# EAGLE design ODR_override rev E (EAGLE 7.5.0)
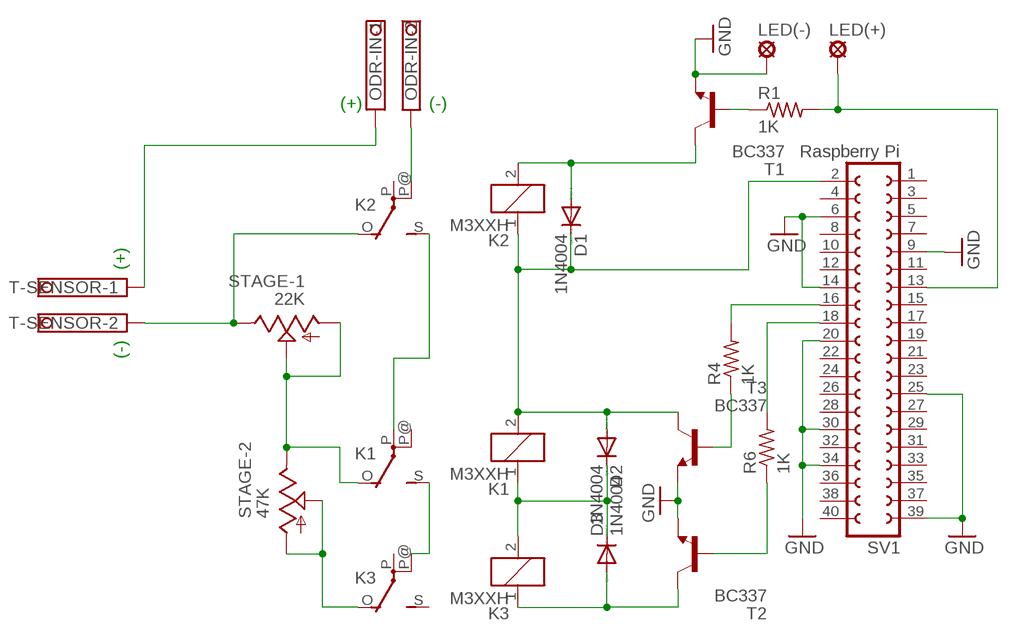
[diagram p0: schematic, sheet 1]

## Parts
D1  1N4004  [DO41-10]
D2  1N4004  [DO41-10]
D3  1N4004  [DO41-10]
K1  M3XXH  [M3XXH]
K2  M3XXH  [M3XXH]
K3  M3XXH  [M3XXH]
LED(+)  LSP11  [LSP11]
LED(-)  LSP11  [LSP11]
ODR-IN  TERMINAL-BLOCK-3.5MM-2-PIN-ROUND-PAD  [TERMINAL-BLOCK-2-PIN-3.5MM-ROUND-PAD]
R1  1K  R-US_0204/5  [0204/5]
R4  1K  R-US_0204/5  [0204/5]
R6  1K  R-US_0204/5  [0204/5]
STAGE-1  22K  TRIM_US-B25P  [B25P]
STAGE-2  47K  TRIM_US-B25P  [B25P]
SV1  Raspberry Pi  FE20-2  [FE20-2]
T1  BC337  [TO92]
T2  BC337  [TO92]
T3  BC337  [TO92]
T-SENSOR  TERMINAL-BLOCK-3.5MM-2-PIN-ROUND-PAD  [TERMINAL-BLOCK-2-PIN-3.5MM-ROUND-PAD]

## Nets
GND: LED(-).MP SV1.6 SV1.9 SV1.14 SV1.20 SV1.25 SV1.30 SV1.34 SV1.39 T1.1(E) T2.1(E) T3.1(E)
N$1: LED(+).MP R1.2 SV1.13
N$2: R1.1 T1.2(B)
N$3: K1.S(2:S) K3.P@(2:P)
N$4: K2.P@(2:P) ODR-IN.2
N$5: D1.C D2.A K1.2 K2.1 SV1.2 T3.3(C)
N$6: D3.A K3.1 T2.3(C)
N$7: ODR-IN.1 T-SENSOR.1
N$8: K1.O(2:O) STAGE-1.A STAGE-1.S STAGE-2.E
N$9: D1.A K2.2 T1.3(C)
N$10: R6.2 SV1.18
N$11: D2.C D3.C K1.1 K3.2
N$12: R4.2 SV1.16
N$13: R6.1 T2.2(B)
N$14: R4.1 T3.2(B)
N$15: K2.O(2:O) STAGE-1.E T-SENSOR.2
N$16: K1.P(2:P) K2.S(2:S)
N$17: K3.O(2:O) STAGE-2.A STAGE-2.S
Unconnected: K1.P@(2:P) K2.P(2:P) K3.P(2:P) K3.S(2:S) SV1.1 SV1.3 SV1.4 SV1.5 SV1.7 SV1.8 SV1.10 SV1.11 SV1.12 SV1.15 SV1.17 SV1.19 SV1.21 SV1.22 SV1.23 SV1.24 SV1.26 SV1.27 SV1.28 SV1.29 SV1.31 SV1.32 SV1.33 SV1.35 SV1.36 SV1.37 SV1.38 SV1.40

## Notes on the sheet
- (+) | (-)
- (+)
- (-)

## Library data of the parts
D1-D3 = diode:1N4004: DIODE general purpose rectifier, 1 A
K1-K3 = relay:M3XXH: RELAY 1 x switch; OC_FARNELL: unknown; OC_NEWARK: unknown
LED(+) LED(-) = solpad:LSP11: SOLDER PAD drill 1.1 mm
ODR-IN T-SENSOR = Rembrandt Electronics - Terminal Block 3-5mm v1-0:TERMINAL-BLOCK-3.5MM-2-PIN: Terminal Block 3.5mm Pitch: 3,5 mm Number of pins: 2 Created by Rembrandt Electronics www.rembrandtelectronics.com
R1 R4 R6 = rcl:R-US_: RESISTOR, American symbol
STAGE-1 STAGE-2 = pot:TRIM_US-: POTENTIOMETER
SV1 = con-lsta:FE20-2: FEMALE HEADER; OC_FARNELL: unknown; OC_NEWARK: unknown
T1-T3 = transistor:BC337: NPN TRANSISTOR

## Board
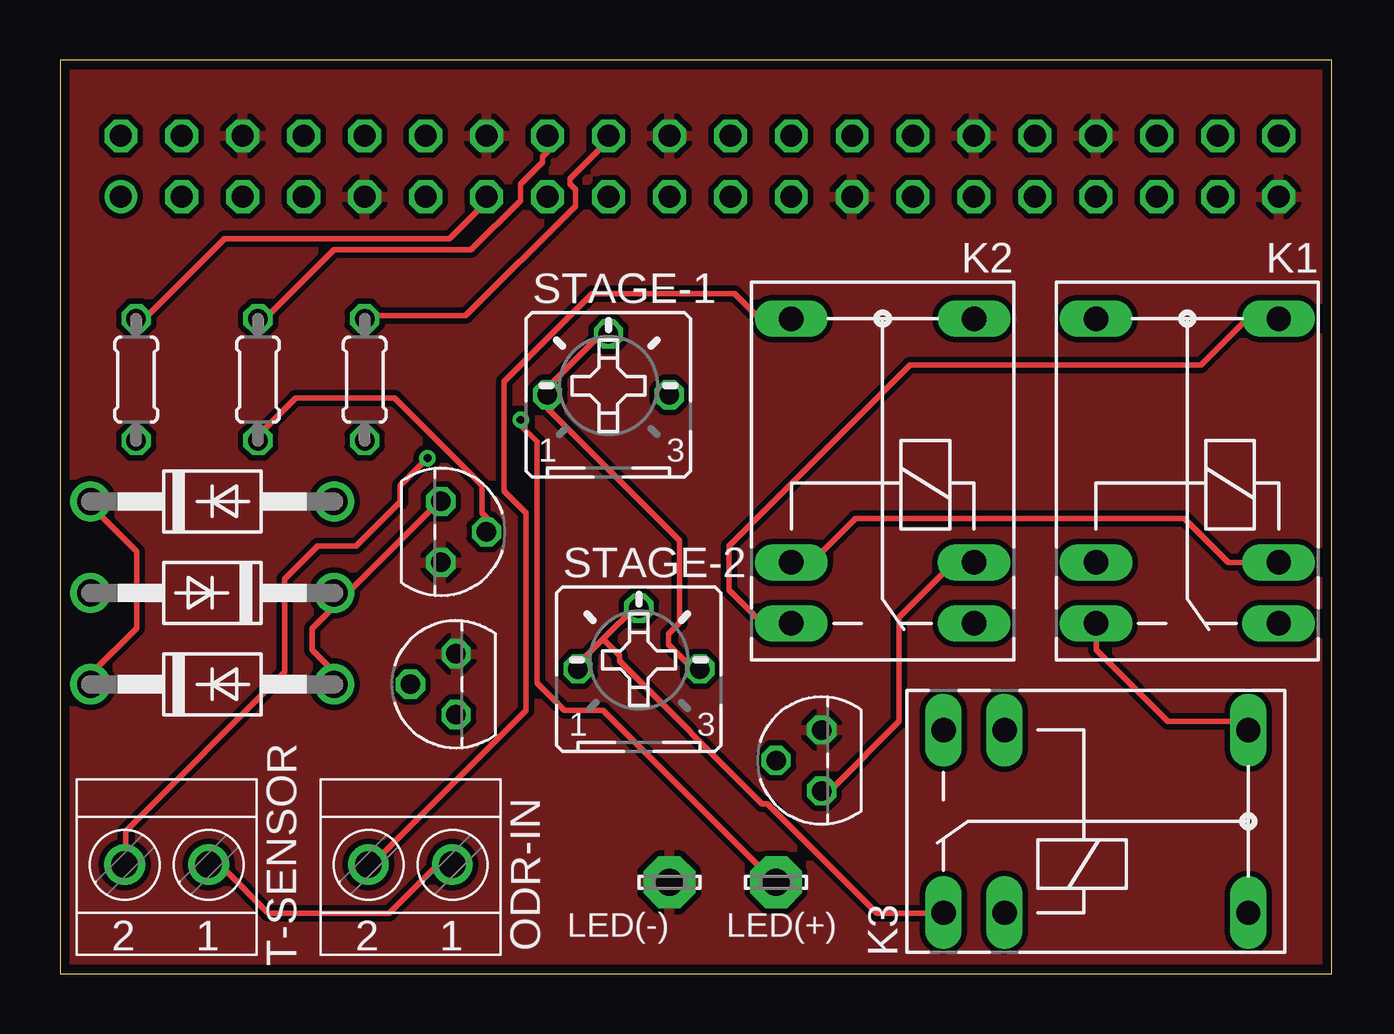
[diagram p1: board, top side]
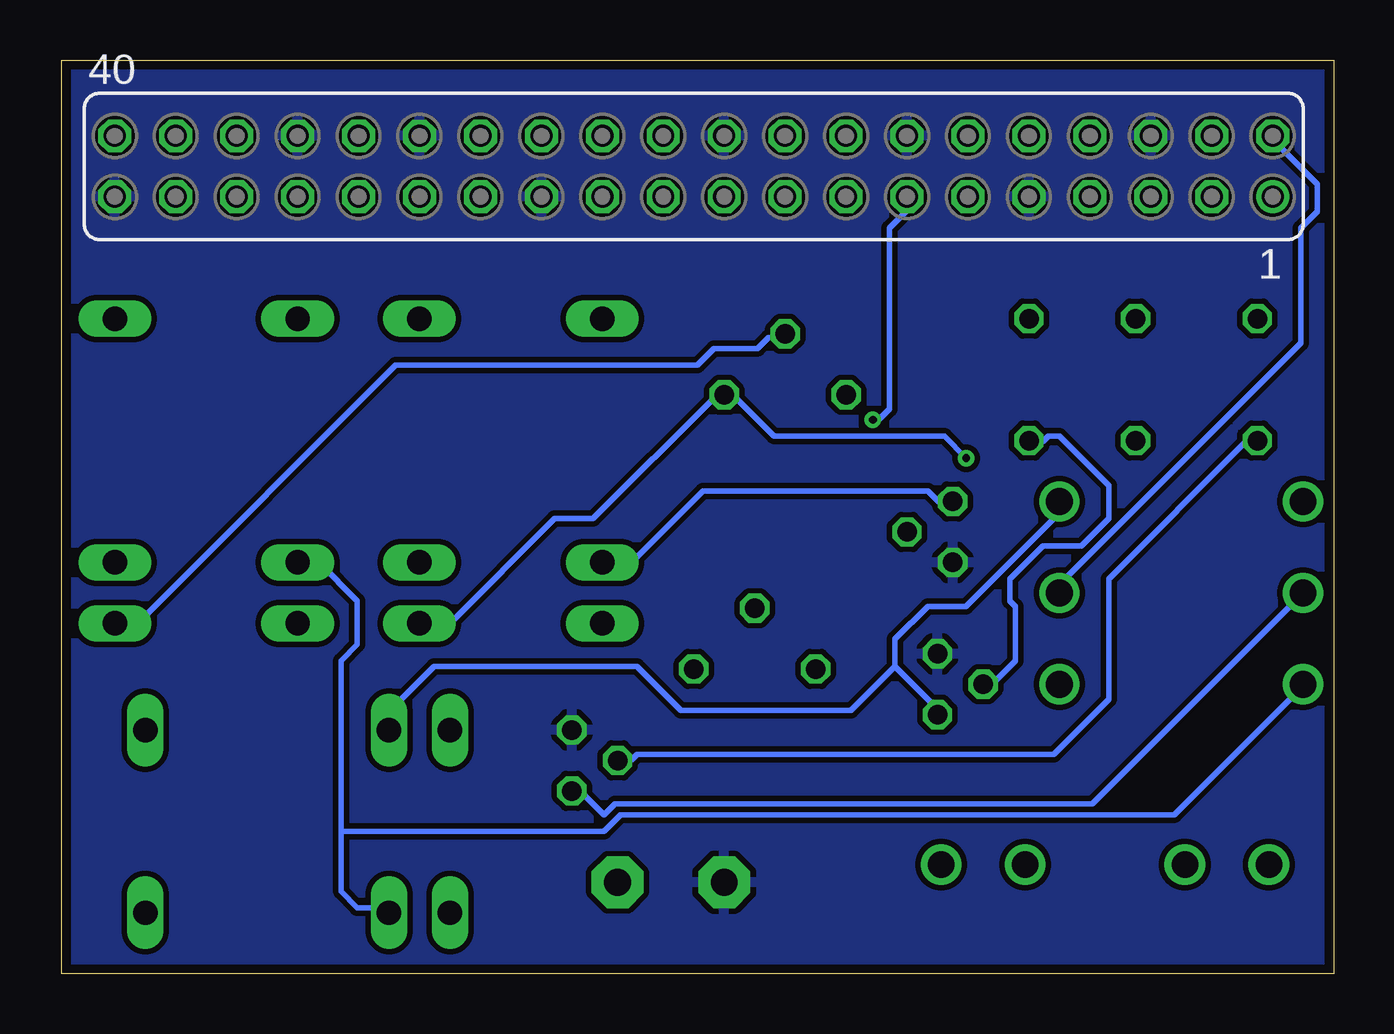
[diagram p2: board, bottom side, seen from below]

Size 53.01 x 38.09 mm. Coordinates in mm from the lower left corner, seen from the top.
Outline: 0,0 53.01,0 53.01,38.09 0,38.09 0,0
Copper layers (1*16): Top 0.0356mm / dielectric 1.5011mm / Bottom 0.0356mm
Design rules "MySettings": minimum track width 9mil, minimum drill 13mil, track to track 9mil, track to pad 9mil, pad to pad 6mil, via to via 6mil, smd to smd 6mil, copper to edge 15mil, drill to drill 6mil, minimum pad ring 8mil, minimum via ring 7mil, stop-mask expansion 4mil, vias tented up to drill 0mil, thermal gap 10mil

### Footprints (pad centres in the part's own frame; a part is rotated, then mirrored left to right if it is on the bottom)
DO41-10 = drill 1.118: A 5.08,0; C -5.08,0
M3XXH = drill 1.016 long: 1 -3.81,3.81; 2 -3.81,-3.81; O -6.35,-3.81; P 6.35,-3.81; P@ 6.35,3.81; S -6.35,3.81
LSP11 = drill 1.118 pad 2.159 octagon: MP 0,0
TERMINAL-BLOCK-2-PIN-3.5MM-ROUND-PAD = drill 1.1 pad 1.7: 1 -1.75,-0.1; 2 1.75,-0.1
0204/5 = drill 0.813 octagon: 1 -2.54,0; 2 2.54,0
B25P = drill 0.813 octagon: A -2.54,0; E 2.54,0; S 0,2.54
FE20-2 = drill 0.914: 1 -24.13,1.27 | drill 0.914 octagon: 2 -24.13,-1.27; 3 -21.59,1.27; 4 -21.59,-1.27; 5 -19.05,1.27; 6 -19.05,-1.27; 7 -16.51,1.27; 8 -16.51,-1.27; 9 -13.97,1.27; 10 -13.97,-1.27; 11 -11.43,1.27; 12 -11.43,-1.27; 13 -8.89,1.27; 14 -8.89,-1.27; 15 -6.35,1.27; 16 -6.35,-1.27; 17 -3.81,1.27; 18 -3.81,-1.27; 19 -1.27,1.27; 20 -1.27,-1.27; 21 1.27,1.27; 22 1.27,-1.27; 23 3.81,1.27; 24 3.81,-1.27; 25 6.35,1.27; 26 6.35,-1.27; 27 8.89,1.27; 28 8.89,-1.27; 29 11.43,1.27; 30 11.43,-1.27; 31 13.97,1.27; 32 13.97,-1.27; 33 16.51,1.27; 34 16.51,-1.27; 35 19.05,1.27; 36 19.05,-1.27; 37 21.59,1.27; 38 21.59,-1.27; 39 24.13,1.27; 40 24.13,-1.27
TO92 = drill 0.813 octagon: 1 1.27,0; 2 0,1.905; 3 -1.27,0

### Placement (x,y rotation side)
D1  6.35,15.88 180 top
D2  6.35,12.06 0 top
D3  6.35,19.68 0 top
K1  46.99,20.95 90 top
K2  34.29,20.95 90 top
K3  43.18,6.35 0 top
LED(+)  29.84,3.81 180 top
LED(-)  25.4,3.81 180 top
ODR-IN  14.61,4.45 180 top
R1  3.17,24.77 90 top
R4  8.26,24.77 90 top
R6  12.7,24.77 90 top
STAGE-1  22.86,24.13 0 top
STAGE-2  24.13,12.7 0 top
SV1  26.67,33.66 180 bottom
T1  31.75,8.89 90 top
T2  16.51,12.06 90 top
T3  15.88,18.41 270 top
T-SENSOR  4.45,4.45 180 top

### Tracks (layer width: path | path; a pad name or v marks a point on that pad's centre or on a via)
GND
  pour Top: 0,38.1 0,0 53.34,0 53.34,38.1
  pour Bottom: 0,38.1 0,0 53.34,0 53.34,38.1
N$1  (via drill 0.33)
  Top 0.229: R1.2 3.2,27.43 3.66,27.43 6.86,30.63 16.23,30.63 17.83,32.23 SV1.13 | v19.2,23.09 19.2,22.86 19.89,22.17 19.89,12.12 21.03,10.97 22.63,10.97 29.72,3.89 LED(+).MP
  Bottom 0.229: v19.2,23.09 18.97,23.09 18.52,23.55 18.52,31.09 17.83,31.77 17.83,32.23 SV1.13
N$2
  Bottom 0.229: R1.1 3.2,22.17 3.66,22.17 9.37,16.46 9.37,11.43 11.66,9.14 29.03,9.14 29.26,8.91 29.72,8.91 T1.2
N$3
  Top 0.229: K1.S 43.2,14.4 43.2,13.49 46.18,10.52 49.15,10.52 49.38,10.29 K3.P@
N$4
  Top 0.229: K2.P@ 30.4,27.43 29.03,27.43 28.12,28.35 22.17,28.35 18.52,24.69 18.52,20.12 19.43,19.2 19.43,10.97 13.03,4.57 ODR-IN.2
N$5
  Top 0.229: T3.3 15.77,19.66 12.12,16 11.43,16 D1.C 11.43,15.32 10.52,14.4 10.52,13.49 11.43,12.57 D2.A | K1.2 48.69,17.14 46.86,18.97 33.15,18.97 31.32,17.14 K2.1
  Bottom 0.229: D1.C 11.43,16.23 1.37,26.29 1.37,31.09 0.69,31.77 0.69,32.92 2.52,34.75 SV1.2 | K2.1 29.26,17.14 26.29,20.12 16.92,20.12 16.46,19.66 16,19.66 T3.3
N$6
  Bottom 0.229: 18.29,12.8 16.69,11.2 16.69,10.97 T2.3 | 18.29,12.8 18.29,13.95 16.92,15.32 15.32,15.32 11.43,19.2 D3.A | 18.29,12.8 20.12,10.97 27.2,10.97 29.03,12.8 37.49,12.8 39.32,10.97 39.32,10.29 K3.1
N$7
  Top 0.229: T-SENSOR.1 6.4,4.34 6.86,4.34 8.69,2.52 13.72,2.52 15.54,4.34 16.23,4.34 ODR-IN.1
N$8
  Top 0.229: STAGE-2.E 26.52,12.8 26.29,12.8 25.38,13.72 25.38,14.17 25.83,14.63 25.83,18.06 20.34,23.55 20.34,24 STAGE-1.A 20.12,24.23 22.4,26.52 22.86,26.52 STAGE-1.S
  Bottom 0.229: K1.O 50.75,14.63 49.84,14.63 39.09,25.38 26.52,25.38 25.83,26.06 24,26.06 23.55,26.52 22.86,26.52 STAGE-1.S
N$9
  Top 0.229: K2.2 37.26,17.14 34.98,14.86 34.98,10.52 32.23,7.77 31.77,7.77 T1.3
  Bottom 0.229: D1.A 10.06,7.09 29.95,7.09 30.4,6.63 31.55,7.77 T1.3
N$10
  Top 0.229: R6.2 12.8,27.43 16.92,27.43 21.49,32 21.49,32.69 21.26,32.92 21.26,33.15 22.86,34.75 SV1.18
N$11
  Top 0.229: D2.C 1.37,12.12 1.37,12.57 3.2,14.4 3.2,17.6 1.14,19.66 D3.C
  Bottom 0.229: 41.38,5.94 41.38,13.03 40.69,13.72 40.69,15.54 42.29,17.14 K1.1 | 41.38,5.94 41.38,3.43 40.69,2.74 39.55,2.74 K3.2 | 41.38,5.94 30.4,5.94 29.72,6.63 6.63,6.63 1.37,11.89 D2.C
N$12
  Top 0.229: R4.2 8.46,27.43 8.69,27.43 11.43,30.18 17.14,30.18 19.2,32.23 19.2,32.92 20.12,33.83 20.12,34.06 20.34,34.29 20.34,34.75 SV1.16
N$13
  Bottom 0.229: T2.2 14.4,12.12 14.17,12.12 13.26,13.03 13.26,15.32 13.49,15.54 13.49,16.46 12.12,17.83 10.52,17.83 9.37,18.97 9.37,20.34 11.43,22.4 11.89,22.4 12.12,22.17 12.57,22.17 R6.1
N$14
  Top 0.229: R4.1 8.46,22.4 8.46,22.63 9.83,24 13.95,24 17.6,20.34 17.6,19.2 17.83,18.97 17.83,18.52 T3.2
N$15  (via drill 0.33)
  Top 0.229: v15.32,21.49 14.17,20.34 14.17,19.66 12.34,17.83 10.74,17.83 9.37,16.46 9.37,12.57 2.74,5.94 2.74,4.57 T-SENSOR.2
  Bottom 0.229: K2.O 37.95,14.63 36.8,14.63 32.46,18.97 30.86,18.97 25.83,24 25.6,24 STAGE-1.E 25.38,24 24.92,24 23.32,22.4 16.23,22.4 v15.32,21.49
N$16
  Top 0.229: K2.S 30.4,14.63 29.26,14.63 27.89,16 27.89,17.83 35.43,25.38 47.55,25.38 49.38,27.2 50.75,27.2 K1.P
N$17
  Top 0.229: 22.63,13.95 24,15.32 STAGE-2.S | 22.63,13.95 21.72,13.03 21.72,12.8 STAGE-2.A | 22.63,13.95 23.32,13.26 23.32,13.03 29.26,7.09 29.49,7.09 34.06,2.52 36.8,2.52 K3.O